# EAGLE schematic pre_schematic_v2 (EAGLE 9.7.0)
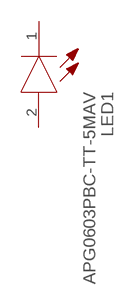
[diagram p0: schematic, sheet 1]

## Parts
LED1  APG0603PBC-TT-5MAV  [0.65X0.35X0.2MM(0201)SMDCHIPLE]
Unconnected: LED1.1(K) LED1.2(A)

## Library data of the parts
LED1 = APG0603PBC-TT-5MAV:APG0603PBC-TT-5MAV: Check availability <https://pricing.snapeda.com/parts/APG0603PBC-TT-5MAV/Kingbright/view-part?ref=eda>; AVAILABILITY: In Stock; CHECK_PRICES: https://www.snapeda.com/parts/APG0603PBC-TT-5MAV/Kingbright/view-part/?ref=eda; DESCRIPTION: Blue 467nm LED Indication - Discrete 2.9V 2-SMD, 0201; MF: Kingbright; MP: APG0603PBC-TT-5MAV; PACKAGE: 0201 Kingbright; PRICE: None; SNAPEDA_LINK: https://www.snapeda.com/parts/APG0603PBC-TT-5MAV/Kingbright/view-part/?ref=snap